# EAGLE design Passive lowpass (EAGLE 6.5.0)
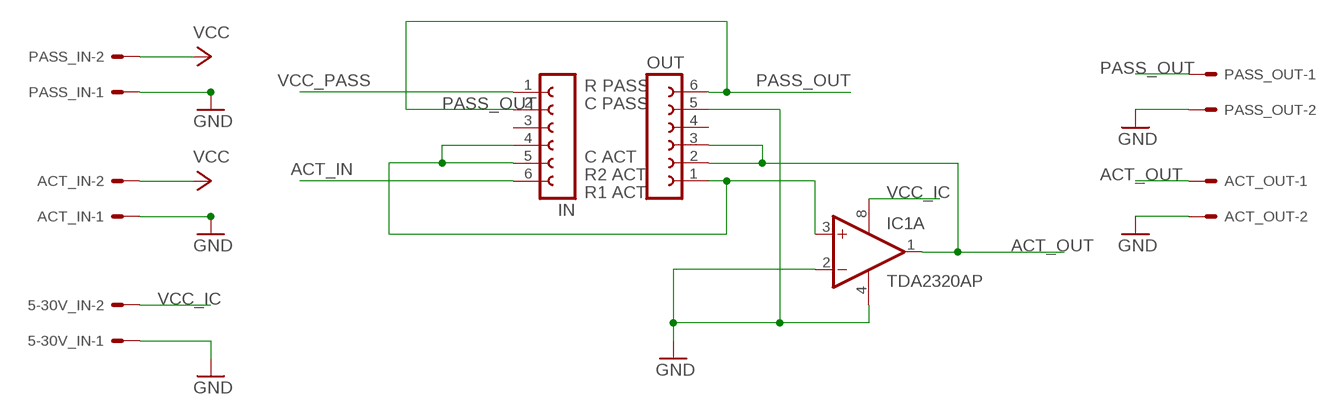
[diagram p0: schematic, sheet 1]

## Parts
5-30V_IN  KK-156-2  [KK-156-2]
ACT_IN  KK-156-2  [KK-156-2]
ACT_OUT  KK-156-2  [KK-156-2]
IC1  TDA2320AP  [DIL08]
IN  FE06W  [FE06W]
OUT  FE06W  [FE06W]
PASS_IN  KK-156-2  [KK-156-2]
PASS_OUT  KK-156-2  [KK-156-2]

## Nets
ACT_IN: IN.6
ACT_OUT: ACT_OUT.1 IC1.1(A:OUT) OUT.2 OUT.3
GND: 5-30V_IN.1 ACT_IN.1 ACT_OUT.2 IC1.2(A:-IN) IC1.4(P:V-) OUT.5 PASS_IN.1 PASS_OUT.2
N$4: IC1.3(A:+IN) IN.4 IN.5 OUT.1
PASS_OUT: IN.2 OUT.6 PASS_OUT.1
VCC: PASS_IN.2
VCC_IC: 5-30V_IN.2 IC1.8(P:V+)
VCC_PASS: ACT_IN.2 IN.1 ; supply symbol labelled VCC
Unconnected: IC1.5(B:+IN) IC1.6(B:-IN) IC1.7(B:OUT) IN.3 OUT.4

## Notes on the sheet
- R PASS
- C PASS
- C ACT
- R2 ACT
- R1 ACT

## Library data of the parts
5-30V_IN ACT_IN ACT_OUT PASS_IN PASS_OUT = con-molex:KK-156-2: KK 156 HEADER Source: http://www.molex.com/pdm_docs/sd/026604100_sd.pdf; OC_FARNELL: unknown; OC_NEWARK: unknown
IC1 = linear:TDA2320A: Power OP AMP
IN OUT = con-lsta:FE06W: FEMALE HEADER; OC_FARNELL: unknown; OC_NEWARK: unknown

## Board
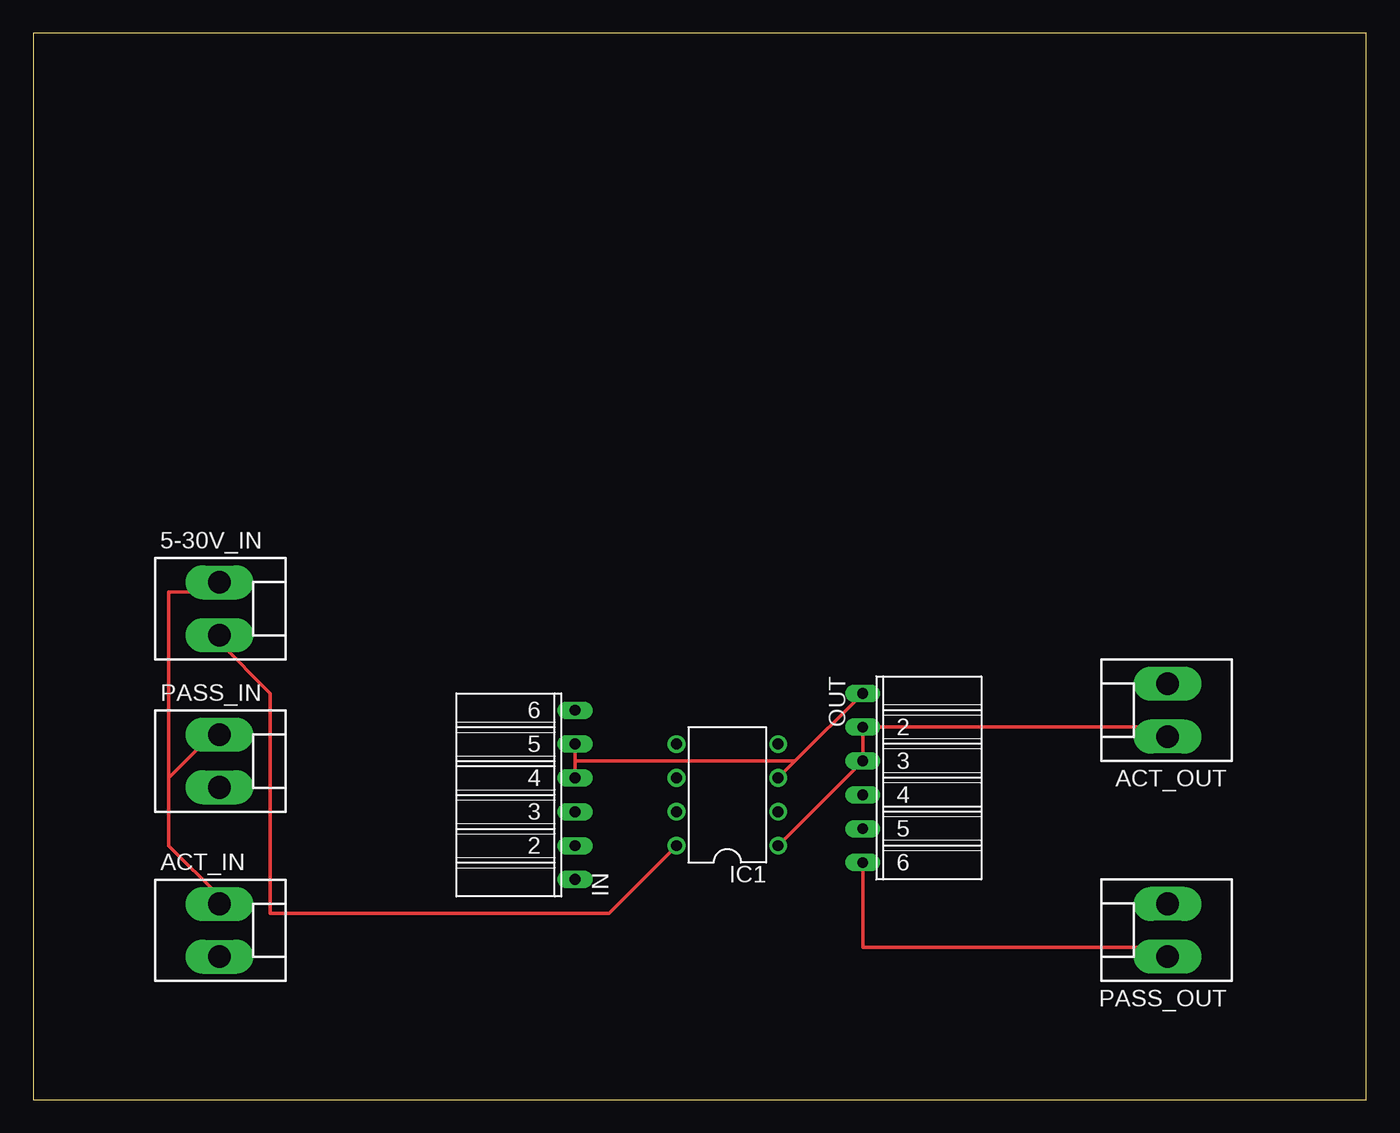
[diagram p1: board, top side]
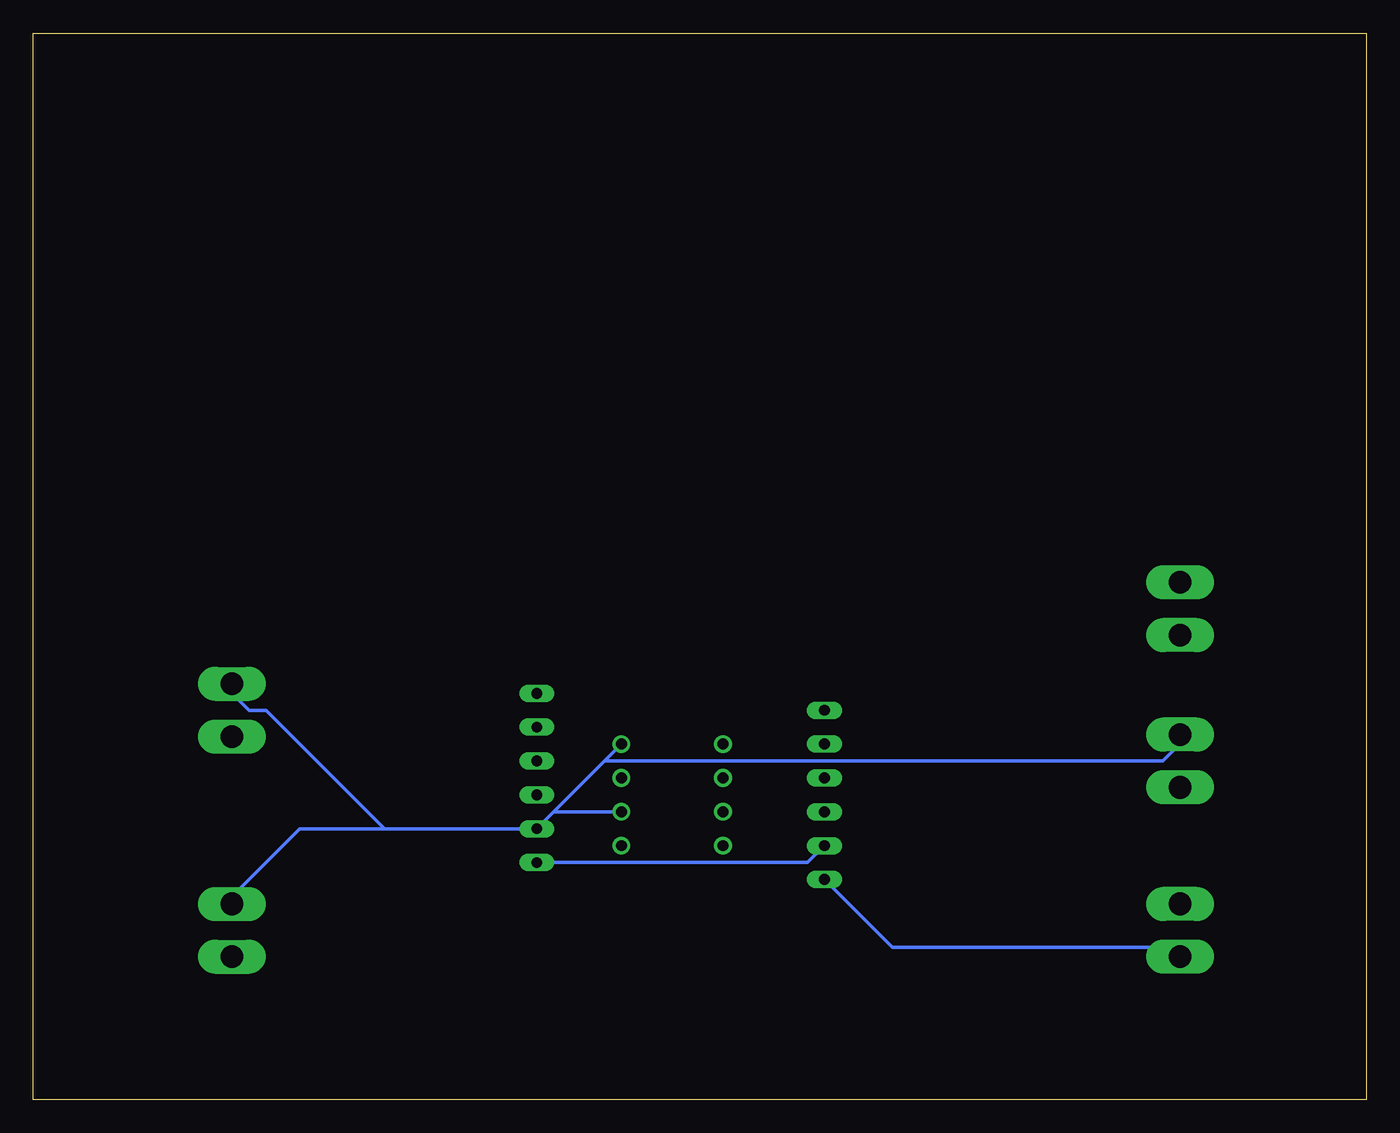
[diagram p2: board, bottom side, seen from below]

Size 100 x 80 mm. Coordinates in mm from the lower left corner, seen from the top.
Outline: 0,0 100,0 100,80 0,80 0,0
Copper layers (1*16): Top 0.035mm / dielectric 1.5mm / Bottom 0.035mm
Design rules "default": minimum track width 10mil, minimum drill 24mil, track to track 8mil, track to pad 8mil, pad to pad 8mil, via to via 8mil, smd to smd 8mil, copper to edge 40mil, drill to drill 8mil, minimum pad ring 10mil, minimum via ring 8mil, stop-mask expansion 4mil, vias tented up to drill 0mil, thermal gap 10mil

### Footprints (pad centres in the part's own frame; a part is rotated, then mirrored left to right if it is on the bottom)
KK-156-2 = drill 1.7 pad 2.184 long: 1 -1.98,0; 2 1.98,0
DIL08 = drill 0.813 pad 1.27: 1 -3.81,-3.81; 2 -1.27,-3.81; 3 1.27,-3.81; 4 3.81,-3.81; 5 3.81,3.81; 6 1.27,3.81; 7 -1.27,3.81; 8 -3.81,3.81
FE06W = drill 0.813 long: 1 -6.35,0; 2 -3.81,0; 3 -1.27,0; 4 1.27,0; 5 3.81,0; 6 6.35,0

### Placement (x,y rotation side)
5-30V_IN  13.97,36.83 270 top
ACT_IN  13.97,12.7 270 top
ACT_OUT  85.09,29.21 90 top
IC1  52.07,22.86 90 top
IN  40.64,22.86 90 top
OUT  62.23,24.13 270 top
PASS_IN  13.97,25.4 270 top
PASS_OUT  85.09,12.7 90 top

### Tracks (layer width: path | path; a pad name or v marks a point on that pad's centre or on a via)
ACT_OUT
  Top 0.254: IC1.1 OUT.3 OUT.2 85.09,27.94 ACT_OUT.1
GND
  Top 0.254: 10.16,24.13 10.16,19.05 13.97,15.24 ACT_IN.1 | 10.16,24.13 13.97,27.94 PASS_IN.1 | 10.16,24.13 10.16,38.1 13.97,38.1 5-30V_IN.1
  Bottom 0.254: 60.96,21.59 OUT.5 73.66,20.32 | IC1.2 60.96,21.59 | 60.96,21.59 57.15,25.4 | 57.15,25.4 IC1.4 | 73.66,20.32 80.01,20.32 85.09,15.24 PASS_OUT.2 | 73.66,20.32 82.55,29.21 83.82,29.21 85.09,30.48 ACT_OUT.2 | 57.15,25.4 15.24,25.4 13.97,26.67 PASS_IN.1
N$4
  Top 0.254: IN.5 40.64,25.4 | 40.64,25.4 IN.4 | OUT.1 57.15,25.4 | 57.15,25.4 IC1.3 | 57.15,25.4 40.64,25.4
PASS_OUT
  Top 0.254: OUT.6 62.23,11.43 85.09,11.43 PASS_OUT.1
  Bottom 0.254: IN.2 41.91,17.78 OUT.6
VCC_IC
  Top 0.254: IC1.8 43.18,13.97 17.78,13.97 17.78,30.48 13.97,34.29 5-30V_IN.2
VCC_PASS
  Bottom 0.254: IN.1 35.56,11.43 13.97,11.43 ACT_IN.2